# Altium schematic sheet DIY Teensy 3.6 rev 3e.SchDoc: Secure CAN Logger
size Letter portrait; Organization: Dr. Jeremy Daily; Address1: Systems Engineering; Address2: Engineering A202; Address3: Fort Collins, CO 80523; Address4: www.engr.colostate.edu/se/; DocumentNumber: DIY Teensy 3.6 with K66; Revision: 3e; SheetNumber: 3; SheetTotal: 3
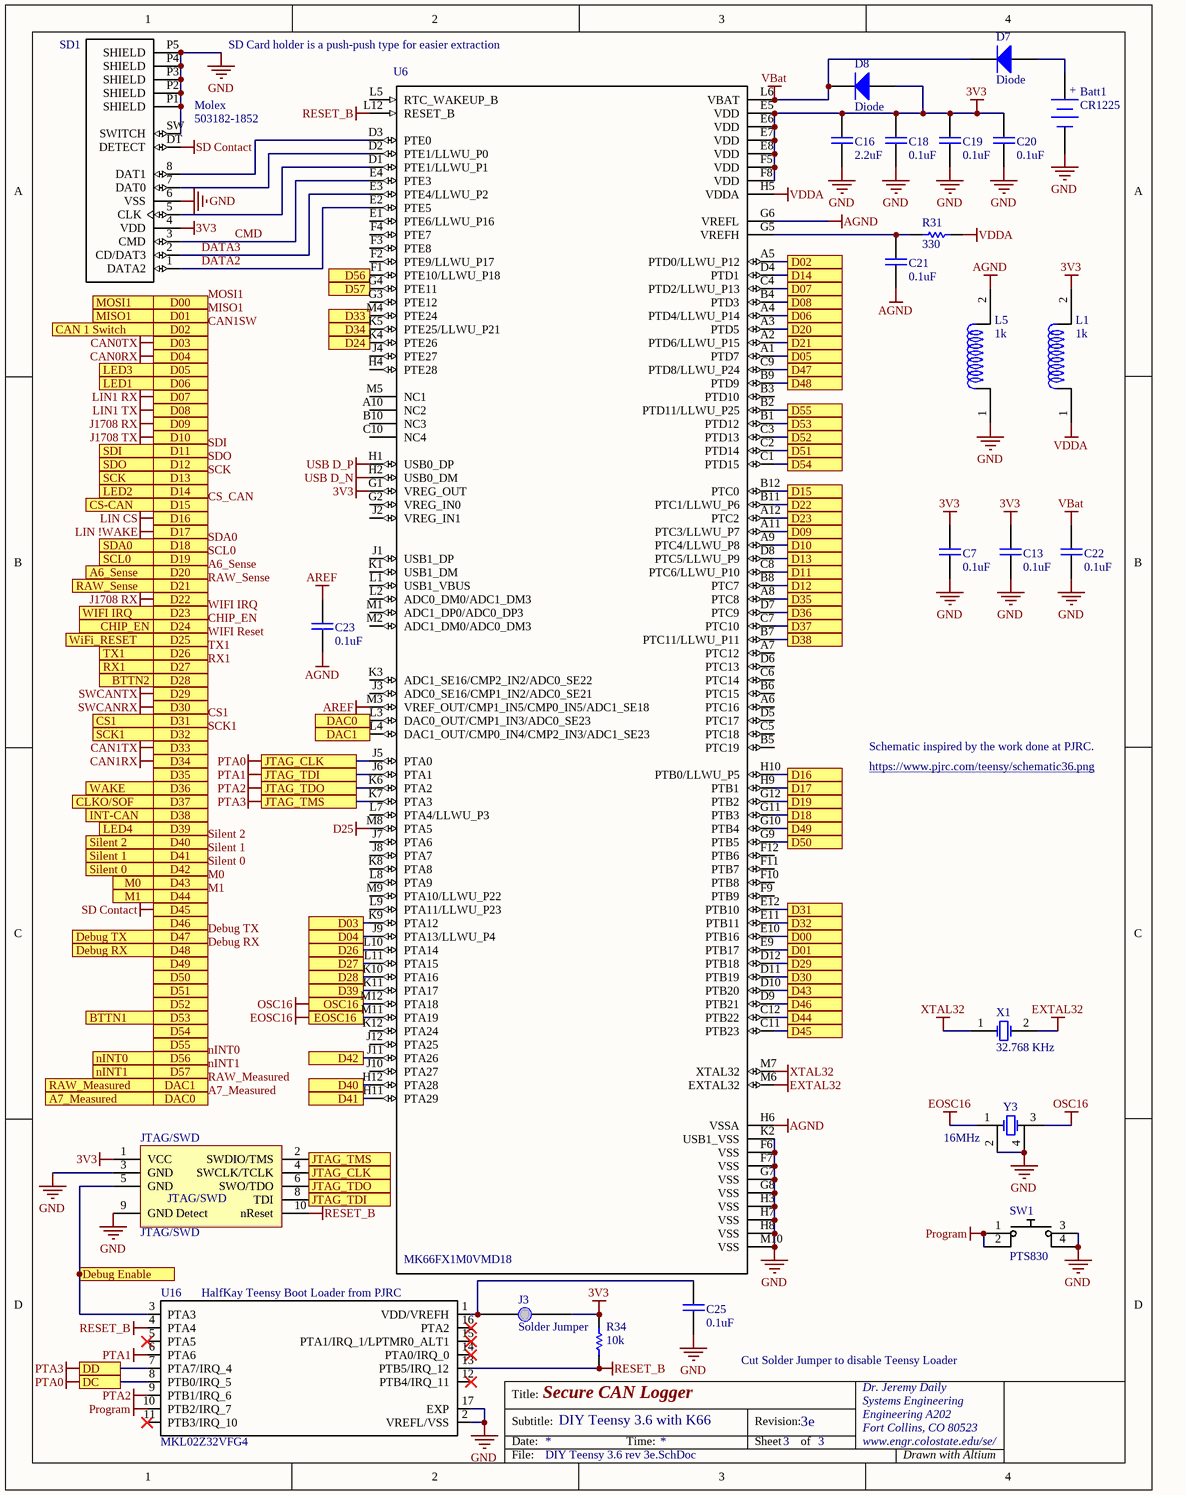
[diagram p0: DIY Teensy 3.6 rev 3e.SchDoc]

## Parts
Batt1  CR1225  [Battery Clip - CR1225]
C7  0.1uF  [0603]
C13  0.1uF  [0603]
C16  2.2uF  [0603]
C18  0.1uF  [0603]
C19  0.1uF  [0603]
C20  0.1uF  [0603]
C21  0.1uF  [0603]
C22  0.1uF  [0603]
C23  0.1uF  [0603]
C25  0.1uF  [0603]
D7  Diode  [CST2C]
D8  Diode  [CST2C]
J3  Solder Jumper  [Solder Jumper]
JTAG/SWD  JTAG/SWD  [JTAG 10-pin Header]
L1  1k  [0603]
L5  1k  [0603]
R31  330  [0603]
R34  10k  [0603]
SD1  503182-1852  Manufacturer: Molex  [*MOLEX_503182-1852_503182-1852(Primary)]
SW1  PTS830  [Switch PTS830]
U6  MK66FX1M0VMD18  [*BGA144C100P12X12_1300X1300X170_MK66FX1M0VMD18(Primary)]
U16  MKL02Z32VFG4  [*QFN50P300X300X65-17N]
X1  32.768 KHz  [XTAL 2-pad Small]
Y3  16MHz  [XTAL 4 pad]

## Ports
A6_Sense, A7_Measured, BTTN1, BTTN2, CAN 1 Switch, CHIP_EN, CLKO/SOF, CS1, CS-CAN, D00, D01, D02, D03, D04, D05, D06, D07, D08, D09, D10, D11, D12, D13, D14, D15, D16, D17, D18, D19, D20, D21, D22, D23, D24, D25, D26, D27, D28, D29, D30, D31, D32, D33, D34, D35, D36, D37, D38, D39, D40, D41, D42, D43, D44, D45, D46, D47, D48, D49, D50, D51, D52, D53, D54, D55, D56, D57, DAC0, DAC1, DC, DD, Debug Enable, Debug RX, Debug TX, EOSC16, INT-CAN, JTAG_CLK, JTAG_TDI, JTAG_TDO, JTAG_TMS, LED1, LED2, LED3, LED4, M0, M1, MISO1, MOSI1, nINT0, nINT1, OSC16, RAW_Measured, RAW_Sense, RX1, SCK, SCK1, SCL0, SDA0, SDI, SDO, Silent 0, Silent 1, Silent 2, TX1, WAKE, WIFI IRQ, WiFi_RESET

## Nets
3V3: C7.2 C13.2 C16.2 C18.2 C19.2 C20.2 D8.1(A) J3.2 JTAG/SWD.1(VCC) L1.2 R34.1 SD1.4(VDD) U6.E5(VDD) U6.E6(VDD) U6.E7(VDD) U6.E8(VDD) U6.F5(VDD) U6.F8(VDD) U6.G1(VREG_OUT)
AGND: C21.1 C23.1 L5.2 U6.G6(VREFL) U6.H6(VSSA)
AREF: C23.2 U6.M3(VREF_OUT/CMP1_IN5/CMP0_IN5/ADC1_SE18)
CAN0RX: U6.J9(PTA13/LLWU_P4) ; port D04
CAN0TX: U6.K9(PTA12) ; port D03
CAN1RX: U6.K5(PTE25/LLWU_P21) ; port D34
CAN1TX: U6.M4(PTE24) ; port D33
D25: U6.M8(PTA5)
EOSC16: U6.M11(PTA19) Y3.1(OSC1) ; port EOSC16
EXTAL32: U6.M6(EXTAL32) X1.2(OSC2)
GND: Batt1.2(-) C7.1 C13.1 C16.1 C18.1 C19.1 C20.1 C22.1 C25.1 JTAG/SWD.3(GND) JTAG/SWD.9(GND_Detect) L5.1 SD1.6(VSS) SD1.P1(SHIELD) SD1.P2(SHIELD) SD1.P3(SHIELD) SD1.P4(SHIELD) SD1.P5(SHIELD) SD1.SW(SWITCH) SW1.3 SW1.4 U6.F6(VSS) U6.F7(VSS) U6.G7(VSS) U6.G8(VSS) U6.H3(VSS) U6.H7(VSS) U6.H8(VSS) U6.K2(USB1_VSS) U6.M10(VSS) U16.2(VREFL/VSS) U16.17(EXP) Y3.2(OSC2) Y3.4(GND)
J1708 RX: U6.A11(PTC3/LLWU_P7) U6.B11(PTC1/LLWU_P6) ; port D09, port D22
J1708 TX: U6.A9(PTC4/LLWU_P8) ; port D10
LIN1 RX: U6.C4(PTD2/LLWU_P13) ; port D07
LIN1 TX: U6.B4(PTD3) ; port D08
LIN !WAKE: U6.H9(PTB1) ; port D17
LIN CS: U6.H10(PTB0/LLWU_P5) ; port D16
OSC16: U6.M12(PTA18) Y3.3(OSC2) ; port OSC16
Program: SW1.1 SW1.2 U16.10(PTB2/IRQ_7)
PTA0: JTAG/SWD.4(SWCLK/TCLK) U6.J5(PTA0) U16.8(PTB0/IRQ_5) ; port DC, port JTAG_CLK
PTA1: JTAG/SWD.8(TDI) U6.J6(PTA1) U16.6(PTA6) ; port JTAG_TDI
PTA2: JTAG/SWD.6(SWO/TDO) U6.K6(PTA2) U16.9(PTB1/IRQ_6) ; port JTAG_TDO
PTA3: JTAG/SWD.2(SWDIO/TMS) U6.K7(PTA3) U16.7(PTA7/IRQ_4) ; port DD, port JTAG_TMS
RESET_B: JTAG/SWD.10(nReset) R34.2 U6.L12(RESET_B) U16.4(PTA4) U16.13(PTB5/IRQ_12)
SD Contact: SD1.DT(DETECT) U6.C11(PTB23) ; port D45
SWCANRX: U6.D11(PTB19) ; port D30
SWCANTX: U6.D12(PTB18) ; port D29
USB D_N: U6.H2(USB0_DM)
USB D_P: U6.H1(USB0_DP)
VBat: C22.2 D7.2(K) D8.2(K) U6.L6(VBAT)
VDDA: L1.1 R31.1 U6.H5(VDDA)
XTAL32: U6.M7(XTAL32) X1.1(OSC1)
A6_Sense: U6.A3(PTD5) ; port A6_Sense, port D20
A7_Measured: U6.L3(DAC0_OUT/CMP1_IN3/ADC0_SE23) ; port A7_Measured, port DAC0
BTTN1: U6.B1(PTD12) ; port BTTN1, port D53
BTTN2: U6.K10(PTA16) ; port BTTN2, port D28
CAN1SW: U6.A5(PTD0/LLWU_P12) ; port CAN 1 Switch, port D02
CHIP_EN: U6.K4(PTE26) ; port CHIP_EN, port D24
CLKO/SOF: U6.C7(PTC10) ; port CLKO/SOF, port D37
CMD: SD1.3(CMD) U6.E4(PTE3)
CS1: U6.E12(PTB10) ; port CS1, port D31
CS_CAN: U6.B12(PTC0) ; port CS-CAN, port D15
D05: U6.A1(PTD7) ; port LED3, port D05
D06: U6.A4(PTD4/LLWU_P14) ; port LED1, port D06
D14: U6.D4(PTD1) ; port LED2, port D14
D35: U6.A8(PTC8) ; port D35
D36: U6.D7(PTC9) ; port WAKE, port D36
D38: U6.B7(PTC11/LLWU_P11) ; port INT-CAN, port D38
D39: U6.K11(PTA17) ; port LED4, port D39
D46: U6.D9(PTB21) ; port D46
D49: U6.G10(PTB4) ; port D49
D50: U6.G9(PTB5) ; port D50
D51: U6.C2(PTD14) ; port D51
D52: U6.C3(PTD13) ; port D52
D54: U6.C1(PTD15) ; port D54
D55: U6.B2(PTD11/LLWU_P25) ; port D55
DATA2: SD1.1(DATA2) U6.E2(PTE5)
DATA3: SD1.2(CD/DAT3) U6.E3(PTE4/LLWU_P2)
Debug Enable: JTAG/SWD.5(GND) U16.3(PTA3) ; port Debug Enable
Debug RX: U6.B9(PTD9) ; port Debug RX, port D48
Debug TX: U6.C9(PTD8/LLWU_P24) ; port Debug TX, port D47
M0: U6.D10(PTB20) ; port M0, port D43
M1: U6.C12(PTB22) ; port M1, port D44
MISO1: U6.E9(PTB17) ; port MISO1, port D01
MOSI1: U6.E10(PTB16) ; port MOSI1, port D00
nINT0: U6.F1(PTE10/LLWU_P18) ; port nINT0, port D56
nINT1: U6.G4(PTE11) ; port nINT1, port D57
RAW_Measured: U6.L4(DAC1_OUT/CMP0_IN4/CMP2_IN3/ADC1_SE23) ; port RAW_Measured, port DAC1
RAW_Sense: U6.A2(PTD6/LLWU_P15) ; port RAW_Sense, port D21
RX1: U6.L11(PTA15) ; port RX1, port D27
SCK: U6.D8(PTC5/LLWU_P9) ; port SCK, port D13
SCK1: U6.E11(PTB11) ; port SCK1, port D32
SCL0: U6.G12(PTB2) ; port SCL0, port D19
SDA0: U6.G11(PTB3) ; port SDA0, port D18
SDI: U6.C8(PTC6/LLWU_P10) ; port SDI, port D11
SDO: U6.B8(PTC7) ; port SDO, port D12
Silent 0: U6.J11(PTA26) ; port Silent 0, port D42
Silent 1: U6.H11(PTA29) ; port Silent 1, port D41
Silent 2: U6.H12(PTA28) ; port Silent 2, port D40
TX1: U6.L10(PTA14) ; port TX1, port D26
WIFI IRQ: U6.A12(PTC2) ; port WIFI IRQ, port D23
WIFI Reset: port WiFi_RESET, port D25
NetBatt1_1: Batt1.1(+) D7.1(A)
NetC21_2: C21.2 R31.2 U6.G5(VREFH)
NetC25_2: C25.2 J3.1 U16.1(VDD/VREFH)
NetSD1_5: SD1.5(CLK) U6.D1(PTE1/LLWU_P1)
NetSD1_7: SD1.7(DAT0) U6.D2(PTE1/LLWU_P0)
NetSD1_8: SD1.8(DAT1) U6.D3(PTE0)

Not connected (* = marked no-connect by the designer): U6 A6(PTC16) A7(PTC12) A10(NC2) B3(PTD10) B5(PTC19) B6(PTC15) B10(NC3) C5(PTC18) C6(PTC14) C10(NC4) D5(PTC17) D6(PTC13) E1(PTE6/LLWU_P16) F2(PTE9/LLWU_P17) F3(PTE8) F4(PTE7) F9(PTB9) F10(PTB8) F11(PTB7) F12(PTB6) G2(VREG_IN0) G3(PTE12) H4(PTE28) J1(USB1_DP) J2(VREG_IN1) J3(ADC0_SE16/CMP1_IN2/ADC0_SE21) J4(PTE27) J7(PTA6) J8(PTA7) J10(PTA27) J12(PTA25) K1(USB1_DM) K3(ADC1_SE16/CMP2_IN2/ADC0_SE22) K8(PTA8) K12(PTA24) L1(USB1_VBUS) L2(ADC0_DM0/ADC1_DM3) L5(RTC_WAKEUP_B) L7(PTA4/LLWU_P3) L8(PTA9) L9(PTA11/LLWU_P23) M1(ADC1_DP0/ADC0_DP3) M2(ADC1_DM0/ADC0_DM3) M5(NC1) M9(PTA10/LLWU_P22); U16 5(PTA5)* 11(PTB3/IRQ_10)* 12(PTB4/IRQ_11)* 14(PTA0/IRQ_0)* 15(PTA1/IRQ_1/LPTMR0_ALT1)* 16(PTA2)*

## Notes on the sheet
- SD Card holder is a push-push type for easier extraction
- Schematic inspired by the work done at PJRC.
- https://www.pjrc.com/teensy/schematic36.png
- (near U16) HalfKay Teensy Boot Loader from PJRC
- Cut Solder Jumper to disable Teensy Loader
- Title:
- Subtitle:
- Date:
- Time:
- Revision:
- Sheet
- of
- File:
- Drawn with Altium

## Library data of the parts
Batt1 = CR2032 Battery Holder: Lithium Battery Non-Rechargeable (Primary) 3V Coin, 12.5mm; Manufacturer: Linx; PartNumber: BAT-HLD-012-SMT; Supplier 1: Digi-Key; Supplier Part Number 1: BAT-HLD-012-SMT-ND
C7 C13 C18-C23 C25 = Cap: CAP CER 0.1UF 50V X7R 0603; Manufacturer: KEMET; PartNumber: C0603C104K5RACAUTO; Alternative: Acceptable; Supplier 1: Digi-Key; Supplier Part Number 1: 399-6856-1-ND
C16 = Cap: 2.2µF ±10% 6.3V Ceramic Capacitor X5R 0603 (1608 Metric); Manufacturer: Taiyo Yuden; PartNumber: JMK107BJ225KAHT; Alternative: Acceptable; Supplier 1: Digi-Key; Supplier Part Number 1: 587-3386-1-ND
D7 D8 = Diode: Default Diode; Manufacturer: Toshiba Semiconductor and Storage; PartNumber: CCS15S30L3FCT-ND; Supplier 1: Digi-Key; Supplier Part Number 1: CCS15S30L3FCT-ND
JTAG/SWD = JTAG Cortex: Connector Header Surface Mount 10 position 0.050" (1.27mm); Manufacturer: CNC Tech; PartNumber: 3221-10-0300-00; Supplier 1: Digi-Key; Supplier Part Number 1: 1175-1735-ND
L1 L5 = Ferrite Bead: 1 kOhms @ 100MHz 1 Power Line Ferrite Bead 0603 (1608 Metric) 1A 200mOhm; Manufacturer: Murata; PartNumber: BLM18KG102SN1D; Alternative: Acceptable; Supplier 1: Digi-Key; Supplier Part Number 1: 490-17349-1-ND
R31 = Chip Resistor: 330 Ohms ±1% 0.1W, 1/10W Chip Resistor 0603 (1608 Metric) Automotive AEC-Q200, High Voltage Thick Film; Manufacturer: Rohm Semiconductor; PartNumber: KTR03EZPF3300; Alternative: Acceptable; Supplier 1: Digi-Key; Supplier Part Number 1: RHM330AYCT-ND
R34 = Chip Resistor: 10 kOhms ±1% 0.1W, 1/10W Chip Resistor 0603 (1608 Metric) Automotive AEC-Q200, High Voltage Thick Film; Manufacturer: Rohm Semiconductor; PartNumber: KTR03EZPF1002; Alternative: Acceptable; Supplier 1: Digi-Key; Supplier Part Number 1: RHM10.0KAYCT-ND
SD1 = 503182-1852: MICRO SD NORMAL ULTRALOWPRO8CKTE; PartNumber: 5031821852; Supplier Part Number 1: WM12834CT-ND; Supplier 1: Digi-Key
SW1 = Switch - Tactile_2: Tactile Switch SPST-NO Top Actuated Surface Mount; Manufacturer: C & K Components; PartNumber: PTS830GM140 SMTR LFS; Supplier 1: Digi-Key; Supplier Part Number 1: CKN10587CT-ND
U6 = MK66FX1M0VMD18: Kinetis K66: 180MHz Cortex-M4F MCU, 1.2MB Flash, 256KB SRAM, 2xUSB, Ethernet, 144-MAPBGA; Manufacturer: NXP USA Inc.; PartNumber: MK66FX1M0VMD18; Supplier 1: Digi-Key; Supplier Part Number 1: 568-13335-ND
U16 = MKL02Z32VFG4: 32 Bit Microcontroller, Kinetis L Series Ultra Low Power, ARM Cortex-M0+, 48 MHz, 32 KB, 4 KB, 16; Manufacturer: PJRC; PartNumber: Pre Programmed MKL02Z32VFG4; Alternative: Sole Source; Supplier 1: PJRC; Supplier Part Number 1: IC_MKL02Z32_QFN16
X1 = Crystal Oscillator: Canned Oscillator; Manufacturer: ECS Inc.; PartNumber: ECS-.327-CDX-1128; Supplier 1: Digi-Key; Supplier Part Number 1: XC2190CT-ND
Y3 = Crystal with Ground: 16MHz ±30ppm Crystal 18pF 80 Ohms 4-SMD, No Lead; Manufacturer: ECS Inc.; PartNumber: XC2866CT-ND; Supplier Part Number 1: XC2866CT-ND; Supplier 1: Digi-Key